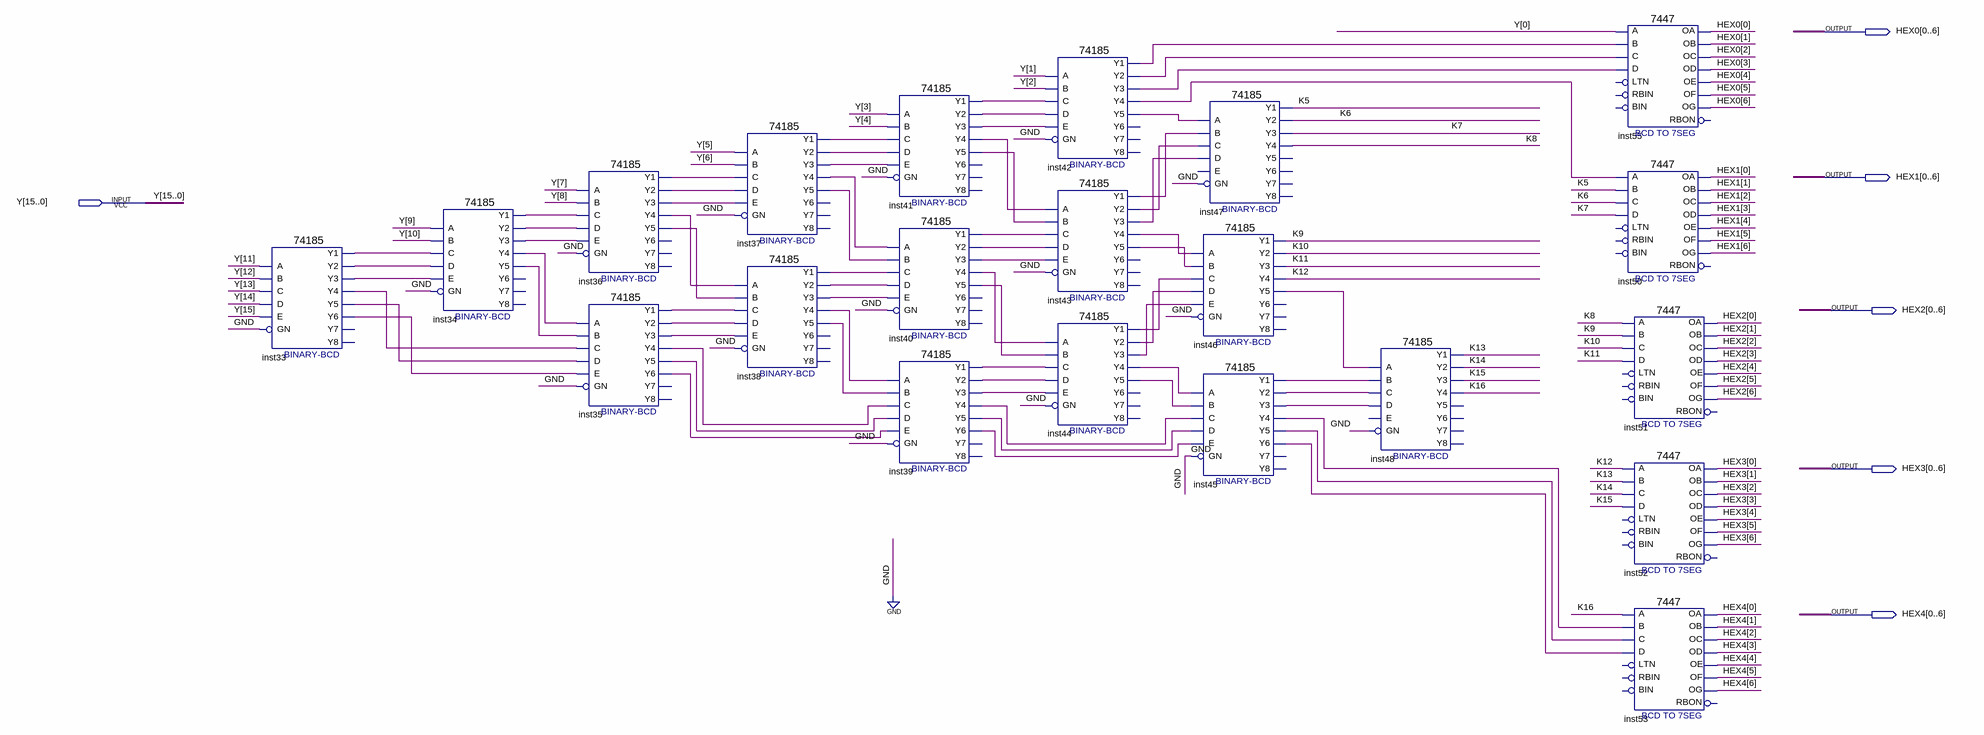
[diagram p0: schematic sheet]
// Quartus schematic DoubleDabble16bits.bdf as structural Verilog: 21 symbols, 6 pins
module DoubleDabble16bits (
  input  [15:0] Y,
  output [0:6] HEX0,
  output [0:6] HEX1,
  output [0:6] HEX2,
  output [0:6] HEX3,
  output [0:6] HEX4
);

  wire inst33_y1, inst33_y2, inst33_y3, inst33_y4, inst33_y5, inst33_y6, inst34_y1, inst34_y2, inst34_y3,
       inst34_y4, inst34_y5, inst35_y1, inst35_y2, inst35_y3, inst35_y4, inst35_y5, inst35_y6, inst36_y1,
       inst36_y2, inst36_y3, inst36_y4, inst36_y5, inst37_y1, inst37_y2, inst37_y3, inst37_y4, inst37_y5,
       inst38_y1, inst38_y2, inst38_y3, inst38_y4, inst38_y5, inst39_y1, inst39_y2, inst39_y3, inst39_y4,
       inst39_y5, inst39_y6, inst40_y1, inst40_y2, inst40_y3, inst40_y4, inst40_y5, inst41_y1, inst41_y2,
       inst41_y3, inst41_y4, inst41_y5, inst42_y1, inst42_y2, inst42_y3, inst42_y4, inst42_y5, inst43_y1,
       inst43_y2, inst43_y3, inst43_y4, inst43_y5, inst44_y1, inst44_y2, inst44_y3, inst44_y4, inst44_y5,
       inst45_y1, inst45_y2, inst45_y3, inst45_y4, inst45_y5, inst45_y6, inst46_y5, K5, K6, K7, K8, K9, K10,
       K11, K12, K13, K14, K15, K16;

  \74185  inst33 (
    .A(Y[11]), .B(Y[12]), .D(Y[14]), .C(Y[13]), .E(Y[15]), .GN(1'b0), .Y1(inst33_y1), .Y3(inst33_y3),
    .Y2(inst33_y2), .Y5(inst33_y5), .Y4(inst33_y4), .Y6(inst33_y6));  // open: Y8, Y7
  \74185  inst34 (
    .A(Y[9]), .B(Y[10]), .D(inst33_y2), .C(inst33_y1), .E(inst33_y3), .GN(1'b0), .Y1(inst34_y1),
    .Y3(inst34_y3), .Y2(inst34_y2), .Y5(inst34_y5), .Y4(inst34_y4));  // open: Y6, Y8, Y7
  \74185  inst36 (
    .A(Y[7]), .B(Y[8]), .D(inst34_y2), .C(inst34_y1), .E(inst34_y3), .GN(1'b0), .Y1(inst36_y1),
    .Y3(inst36_y3), .Y2(inst36_y2), .Y5(inst36_y5), .Y4(inst36_y4));  // open: Y6, Y8, Y7
  \74185  inst35 (
    .A(inst34_y4), .B(inst34_y5), .D(inst33_y5), .C(inst33_y4), .E(inst33_y6), .GN(1'b0), .Y1(inst35_y1),
    .Y3(inst35_y3), .Y2(inst35_y2), .Y5(inst35_y5), .Y4(inst35_y4), .Y6(inst35_y6));  // open: Y8, Y7
  \74185  inst37 (
    .A(Y[5]), .B(Y[6]), .D(inst36_y2), .C(inst36_y1), .E(inst36_y3), .GN(1'b0), .Y1(inst37_y1),
    .Y3(inst37_y3), .Y2(inst37_y2), .Y5(inst37_y5), .Y4(inst37_y4));  // open: Y6, Y8, Y7
  \74185  inst38 (
    .A(inst36_y4), .B(inst36_y5), .D(inst35_y2), .C(inst35_y1), .E(inst35_y3), .GN(1'b0), .Y1(inst38_y1),
    .Y3(inst38_y3), .Y2(inst38_y2), .Y5(inst38_y5), .Y4(inst38_y4));  // open: Y6, Y8, Y7
  \74185  inst41 (
    .A(Y[3]), .B(Y[4]), .D(inst37_y2), .C(inst37_y1), .E(inst37_y3), .GN(1'b0), .Y1(inst41_y1),
    .Y3(inst41_y3), .Y2(inst41_y2), .Y5(inst41_y5), .Y4(inst41_y4));  // open: Y6, Y8, Y7
  \74185  inst40 (
    .A(inst37_y4), .B(inst37_y5), .D(inst38_y2), .C(inst38_y1), .E(inst38_y3), .GN(1'b0), .Y1(inst40_y1),
    .Y3(inst40_y3), .Y2(inst40_y2), .Y5(inst40_y5), .Y4(inst40_y4));  // open: Y6, Y8, Y7
  \74185  inst39 (
    .A(inst38_y4), .B(inst38_y5), .D(inst35_y5), .C(inst35_y4), .E(inst35_y6), .GN(1'b0), .Y1(inst39_y1),
    .Y3(inst39_y3), .Y2(inst39_y2), .Y5(inst39_y5), .Y4(inst39_y4), .Y6(inst39_y6));  // open: Y8, Y7
  \74185  inst42 (
    .A(Y[1]), .B(Y[2]), .D(inst41_y2), .C(inst41_y1), .E(inst41_y3), .GN(1'b0), .Y1(inst42_y1),
    .Y3(inst42_y3), .Y2(inst42_y2), .Y5(inst42_y5), .Y4(inst42_y4));  // open: Y6, Y8, Y7
  \74185  inst43 (
    .A(inst41_y4), .B(inst41_y5), .D(inst40_y2), .C(inst40_y1), .E(inst40_y3), .GN(1'b0), .Y1(inst43_y1),
    .Y3(inst43_y3), .Y2(inst43_y2), .Y5(inst43_y5), .Y4(inst43_y4));  // open: Y6, Y8, Y7
  \74185  inst44 (
    .A(inst40_y4), .B(inst40_y5), .D(inst39_y2), .C(inst39_y1), .E(inst39_y3), .GN(1'b0), .Y1(inst44_y1),
    .Y3(inst44_y3), .Y2(inst44_y2), .Y5(inst44_y5), .Y4(inst44_y4));  // open: Y6, Y8, Y7
  \74185  inst47 (
    .A(inst42_y5), .B(inst43_y1), .D(inst43_y3), .C(inst43_y2), .GN(1'b0), .Y1(K5), .Y3(K7), .Y2(K6), .Y4(K8));  // open: E, Y5, Y6, Y8, Y7
  \74185  inst46 (
    .A(inst43_y4), .B(inst43_y5), .D(inst44_y2), .C(inst44_y1), .E(inst44_y3), .GN(1'b0), .Y1(K9), .Y3(K11),
    .Y2(K10), .Y5(inst46_y5), .Y4(K12));  // open: Y6, Y8, Y7
  \74185  inst45 (
    .A(inst44_y4), .B(inst44_y5), .D(inst39_y5), .C(inst39_y4), .E(inst39_y6), .GN(1'b0), .Y1(inst45_y1),
    .Y3(inst45_y3), .Y2(inst45_y2), .Y5(inst45_y5), .Y4(inst45_y4), .Y6(inst45_y6));  // open: Y8, Y7
  \74185  inst48 (
    .A(inst46_y5), .B(inst45_y1), .D(inst45_y3), .C(inst45_y2), .GN(1'b0), .Y1(K13), .Y3(K15), .Y2(K14),
    .Y4(K16));  // open: E, Y5, Y6, Y8, Y7
  \7447  inst55 (
    .B(inst42_y1), .C(inst42_y2), .D(inst42_y3), .A(Y[0]), .OB(HEX0[1]), .OC(HEX0[2]), .OE(HEX0[4]),
    .OD(HEX0[3]), .OF(HEX0[5]), .OG(HEX0[6]), .OA(HEX0[0]));  // open: LTN, RBIN, BIN, RBON
  \7447  inst50 (
    .B(K5), .C(K6), .D(K7), .A(inst42_y4), .OB(HEX1[1]), .OC(HEX1[2]), .OE(HEX1[4]), .OD(HEX1[3]),
    .OF(HEX1[5]), .OG(HEX1[6]), .OA(HEX1[0]));  // open: LTN, RBIN, BIN, RBON
  \7447  inst51 (
    .B(K9), .C(K10), .D(K11), .A(K8), .OB(HEX2[1]), .OC(HEX2[2]), .OE(HEX2[4]), .OD(HEX2[3]), .OF(HEX2[5]),
    .OG(HEX2[6]), .OA(HEX2[0]));  // open: LTN, RBIN, BIN, RBON
  \7447  inst52 (
    .B(K13), .C(K14), .D(K15), .A(K12), .OB(HEX3[1]), .OC(HEX3[2]), .OE(HEX3[4]), .OD(HEX3[3]), .OF(HEX3[5]),
    .OG(HEX3[6]), .OA(HEX3[0]));  // open: LTN, RBIN, BIN, RBON
  \7447  inst53 (
    .B(inst45_y4), .C(inst45_y5), .D(inst45_y6), .A(K16), .OB(HEX4[1]), .OC(HEX4[2]), .OE(HEX4[4]),
    .OD(HEX4[3]), .OF(HEX4[5]), .OG(HEX4[6]), .OA(HEX4[0]));  // open: LTN, RBIN, BIN, RBON
endmodule
